# EAGLE design dacBreakout (EAGLE 9.6.2)
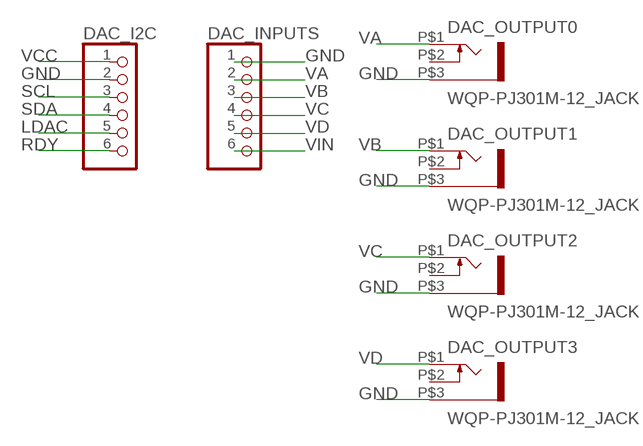
[diagram p0: schematic, sheet 1]

## Parts
DAC_I2C  PINHD-1X6B  [1X06-BIG]
DAC_INPUTS  PINHD-1X6B  [1X06-BIG]
DAC_OUTPUT0  WQP-PJ301M-12_JACK  [WQP-PJ301M-12_JACK]
DAC_OUTPUT1  WQP-PJ301M-12_JACK  [WQP-PJ301M-12_JACK]
DAC_OUTPUT2  WQP-PJ301M-12_JACK  [WQP-PJ301M-12_JACK]
DAC_OUTPUT3  WQP-PJ301M-12_JACK  [WQP-PJ301M-12_JACK]

## Nets
GND: DAC_I2C.2 DAC_INPUTS.1 DAC_OUTPUT0.P$3 DAC_OUTPUT1.P$3 DAC_OUTPUT2.P$3 DAC_OUTPUT3.P$3
LDAC: DAC_I2C.5
RDY: DAC_I2C.6
SCL: DAC_I2C.3
SDA: DAC_I2C.4
VA: DAC_INPUTS.2 DAC_OUTPUT0.P$1
VB: DAC_INPUTS.3 DAC_OUTPUT1.P$1
VC: DAC_INPUTS.4 DAC_OUTPUT2.P$1
VCC: DAC_I2C.1
VD: DAC_INPUTS.5 DAC_OUTPUT3.P$1
VIN: DAC_INPUTS.6
Unconnected: DAC_OUTPUT0.P$2 DAC_OUTPUT1.P$2 DAC_OUTPUT2.P$2 DAC_OUTPUT3.P$2

## Library data of the parts
DAC_I2C DAC_INPUTS = adafruit:PINHD-1X6: PIN HEADER
DAC_OUTPUT0 DAC_OUTPUT1-DAC_OUTPUT3 = thonkiconn:WQP-PJ301M-12_JACK

## Net classes
1 highpower: width 0.305 mm, drill 0.483 mm

## Board
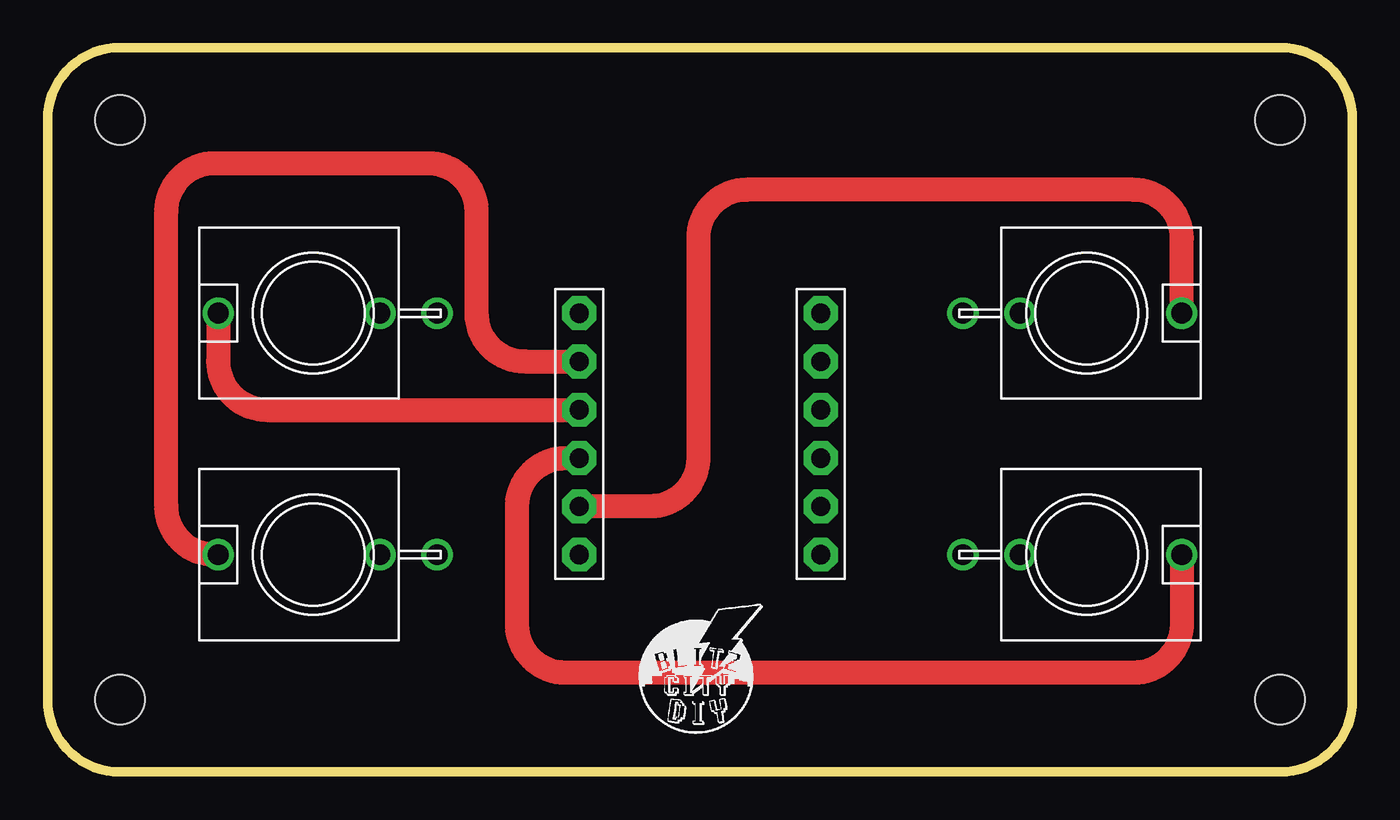
[diagram p1: board, top side]
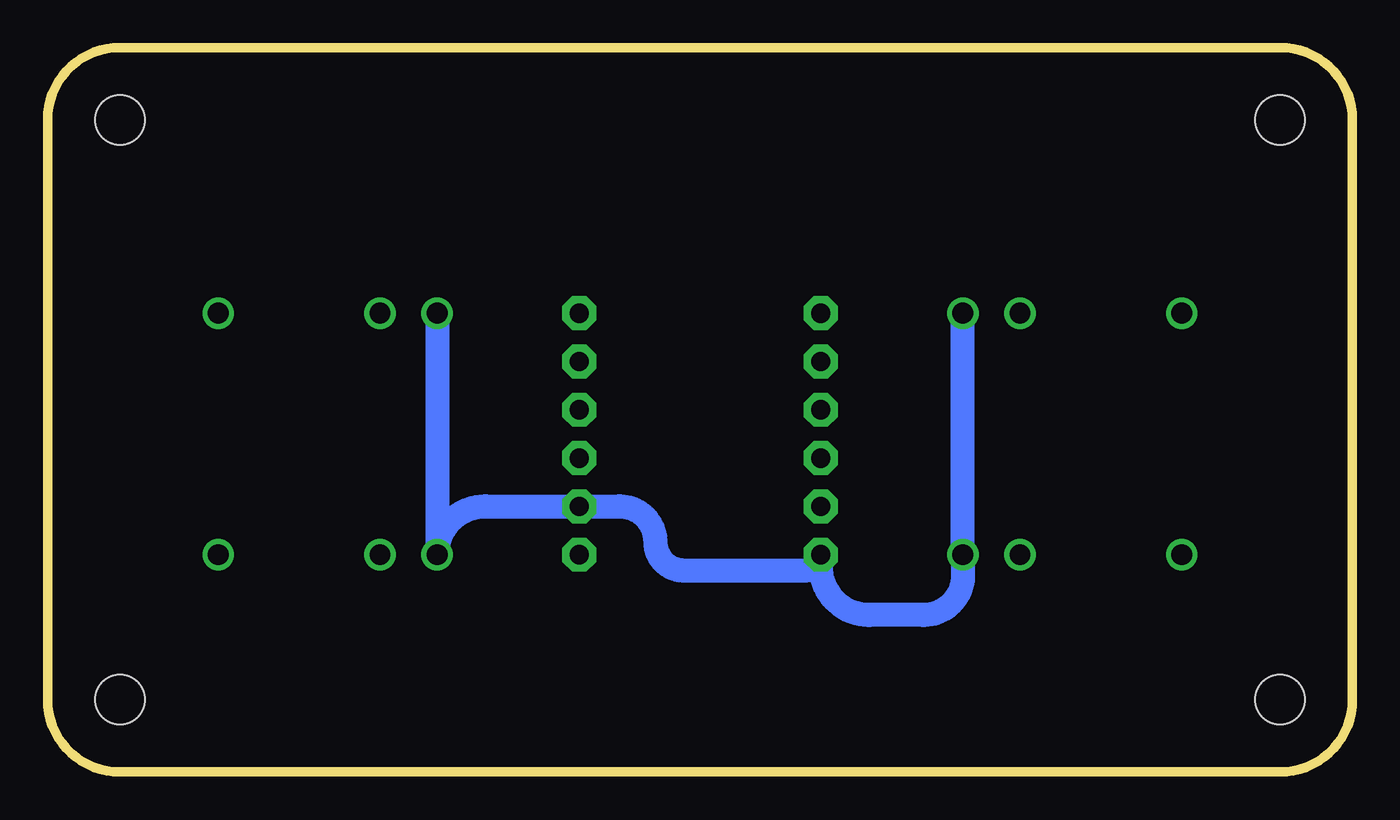
[diagram p2: board, bottom side, seen from below]

Size 68.58 x 38.1 mm. Coordinates in mm from the lower left corner, seen from the top.
Outline: 3.81,38.1 arc90 0,34.29 0,3.81 arc90 3.81,0 64.77,0 arc90 68.58,3.81 68.58,34.29 arc90 64.77,38.1 3.81,38.1
Copper layers (1*16): Top 0.035mm / dielectric 1.5mm / Bottom 0.035mm
Design rules "default": minimum track width 6mil, minimum drill 0.35mm, track to track 6mil, track to pad 6mil, pad to pad 6mil, via to via 6mil, smd to smd 6mil, copper to edge 40mil, drill to drill 6mil, minimum pad ring 10mil, minimum via ring 8mil, stop-mask expansion 4mil, vias tented up to drill 0mil, thermal gap 10mil
Holes 2.6 mm at 3.81,3.81 64.77,3.81 64.77,34.29 3.81,34.29

### Footprints (pad centres in the part's own frame; a part is rotated, then mirrored left to right if it is on the bottom)
1X06-BIG = drill 1.016 pad 1.778 octagon: 1 -6.35,0; 2 -3.81,0; 3 -1.27,0; 4 1.27,0; 5 3.81,0; 6 6.35,0
WQP-PJ301M-12_JACK = drill 1.1: P$1 0,5; P$2 0,-3.5; P$3 0,-6.5

### Placement (x,y rotation side)
DAC_I2C  40.64,17.78 90 top
DAC_INPUTS  27.94,17.78 90 top
DAC_OUTPUT0  54.61,24.13 270 top
DAC_OUTPUT1  54.61,11.43 270 top
DAC_OUTPUT2  13.97,24.13 90 top
DAC_OUTPUT3  13.97,11.43 90 top
PLABEL0  [PLABEL0]  62.36,19.33 90 top
PLABEL1  [PLABEL1]  62.32,6.73 90 top
PLABEL2  [PLABEL2]  7.63,19.42 90 top
PLABEL3  [PLABEL3]  7.67,6.73 90 top
PLABEL4  [PLABEL4]  39.19,10.09 90 top
PLABEL5  [PLABEL5]  30.77,10.04 90 top
PLABEL6  [PLABEL6]  34.57,32.33 0 top
PLABEL7  [PLABEL7]  57.61,21.95 0 bottom
PLABEL8  [PLABEL8]  34.16,7.77 0 bottom

### Tracks (layer width: path | path; a pad name or v marks a point on that pad's centre or on a via)
GND
  Bottom 1.27: DAC_OUTPUT2.P$3 DAC_OUTPUT3.P$3 20.47,10.33 arc90 22.54,8.26 25.4,8.26 arc90 27.94,10.8 DAC_INPUTS.1 arc90 28.77,10.6 35.14,10.6 arc90 36.64,12.1 arc-90 38.51,13.97 DAC_I2C.2 45.57,13.97 arc-90 DAC_OUTPUT1.P$3 DAC_OUTPUT0.P$3
VA
  Top 1.27: DAC_OUTPUT0.P$1 59.61,28.08 arc90 57.07,30.62 36.74,30.62 arc90 34.2,28.08 34.2,16.51 arc-90 31.66,13.97 DAC_INPUTS.2
VB
  Top 1.27: DAC_OUTPUT1.P$1 59.61,7.76 arc-90 57.07,5.22 27.22,5.22 arc-90 24.68,7.76 24.68,13.97 arc-90 27.22,16.51 DAC_INPUTS.3
VC
  Top 1.27: DAC_OUTPUT2.P$1 8.97,21.59 arc90 11.51,19.05 DAC_INPUTS.4
VD
  Top 1.27: DAC_OUTPUT3.P$1 8.78,11.43 arc-90 6.24,13.97 6.24,29.48 arc-90 8.78,32.02 20,32.02 arc-90 22.54,29.48 22.54,24.13 arc90 25.08,21.59 DAC_INPUTS.5

### Text on the board
Pinguin_tBackup: Modular / Melody / Maker / DAC Breakout | OUTPUT 2 | DAC OUTPUTS | OUTPUT 0 | DAC I2C | OUTPUT 3 | OUTPUT 1
Pinguin_bBackup: 🎶🎛🎹 | VERSION 0 / December 2022